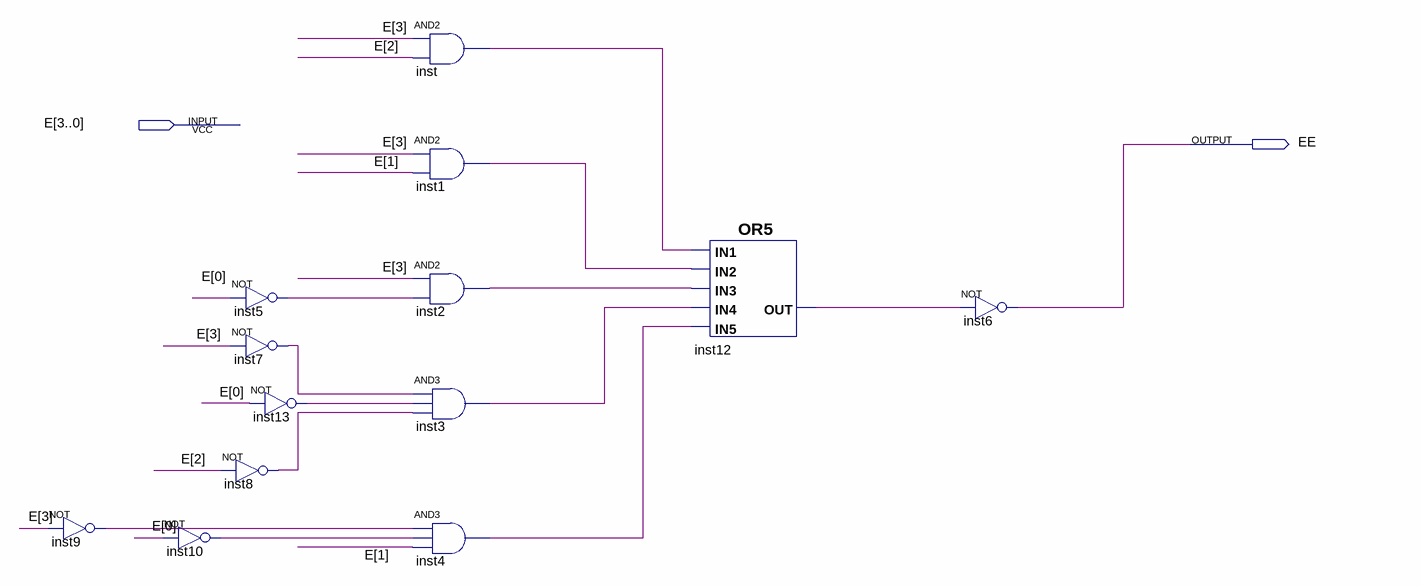
[diagram p0: schematic sheet]
// Quartus schematic displayE.bdf as structural Verilog: 13 symbols, 2 pins
module displayE (
  input  [3:0] E,
  output EE
);

  wire inst1_out, inst2_out, inst3_out, inst4_out, inst5_out, inst7_out, inst8_out, inst9_out, inst10_out,
       inst12_out, inst13_out, inst_out;

  not inst9 (inst9_out, E[3]);
  not inst5 (inst5_out, E[0]);
  not inst7 (inst7_out, E[3]);
  not inst8 (inst8_out, E[2]);
  not inst10 (inst10_out, E[0]);
  not inst13 (inst13_out, E[0]);
  and inst (inst_out, E[3], E[2]);
  and inst1 (inst1_out, E[3], E[1]);
  and inst2 (inst2_out, E[3], inst5_out);
  and inst3 (inst3_out, inst7_out, inst13_out, inst8_out);
  and inst4 (inst4_out, inst9_out, inst10_out, E[1]);
  or inst12 (inst12_out, inst_out, inst1_out, inst2_out, inst3_out, inst4_out);
  not inst6 (EE, inst12_out);
endmodule
